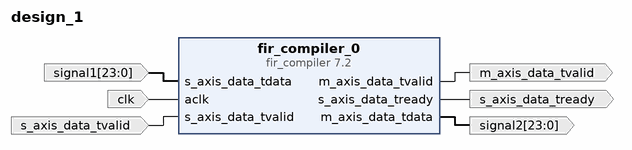
[diagram p0: block diagram of the top level]
# Vivado block design design_1, xc7vx485tffg1157-1, Vivado 2018.3
create_bd_design design_1

create_bd_port -dir I -from 23 -to 0 signal1
create_bd_port -dir O -from 23 -to 0 signal2
create_bd_port -dir I clk
create_bd_port -dir O s_axis_data_tready
create_bd_port -dir I s_axis_data_tvalid
create_bd_port -dir O m_axis_data_tvalid

create_bd_cell -type ip -vlnv xilinx.com:ip:fir_compiler:7.2 fir_compiler_0
set_property -dict [list \
  CONFIG.BestPrecision true \
  CONFIG.Clock_Frequency 300.0 \
  CONFIG.CoefficientVector 0.000612974239942341,0,-0.00139927880755410,0,0.00289011036039714,0,-0.00530600611043049,0,0.00899517643394189,0,-0.0144020336153547,0,0.0221312072433480,0,-0.0330994168638488,0,0.0489140807287789,0,-0.0729290333901684,0,0.113859905464638,0,-0.203879380688593,0,0.633801416611840,1,0.633801416611840,0,-0.203879380688593,0,0.113859905464638,0,-0.0729290333901684,0,0.0489140807287789,0,-0.0330994168638488,0,0.0221312072433480,0,-0.0144020336153547,0,0.00899517643394189,0,-0.00530600611043049,0,0.00289011036039714,0,-0.00139927880755410,0,0.000612974239942341 \
  CONFIG.Coefficient_Fractional_Bits 22 \
  CONFIG.Coefficient_Sets 1 \
  CONFIG.Coefficient_Sign Signed \
  CONFIG.Coefficient_Structure Inferred \
  CONFIG.Coefficient_Width 24 \
  CONFIG.Data_Width 24 \
  CONFIG.Decimation_Rate 1 \
  CONFIG.Filter_Architecture Systolic_Multiply_Accumulate \
  CONFIG.Filter_Type Interpolation \
  CONFIG.Interpolation_Rate 2 \
  CONFIG.Number_Channels 1 \
  CONFIG.Output_Rounding_Mode Convergent_Rounding_to_Even \
  CONFIG.Output_Width 24 \
  CONFIG.Quantization Quantize_Only \
  CONFIG.RateSpecification Frequency_Specification \
  CONFIG.Sample_Frequency 0.001 \
  CONFIG.Zero_Pack_Factor 1 \
] [get_bd_cells fir_compiler_0]

# ---- connections ----

connect_bd_net -net signal1_1 [get_bd_ports signal1] [get_bd_pins fir_compiler_0/s_axis_data_tdata]
connect_bd_net [get_bd_pins fir_compiler_0/m_axis_data_tdata] [get_bd_ports signal2]
connect_bd_net [get_bd_ports clk] [get_bd_pins fir_compiler_0/aclk]
connect_bd_net [get_bd_pins fir_compiler_0/s_axis_data_tready] [get_bd_ports s_axis_data_tready]
connect_bd_net [get_bd_ports s_axis_data_tvalid] [get_bd_pins fir_compiler_0/s_axis_data_tvalid]
connect_bd_net [get_bd_pins fir_compiler_0/m_axis_data_tvalid] [get_bd_ports m_axis_data_tvalid]

validate_bd_design
save_bd_design
